# Altium schematic sheet LoRaSubsystem.SchDoc
size A4; SheetNumber: 3; SheetTotal: 14
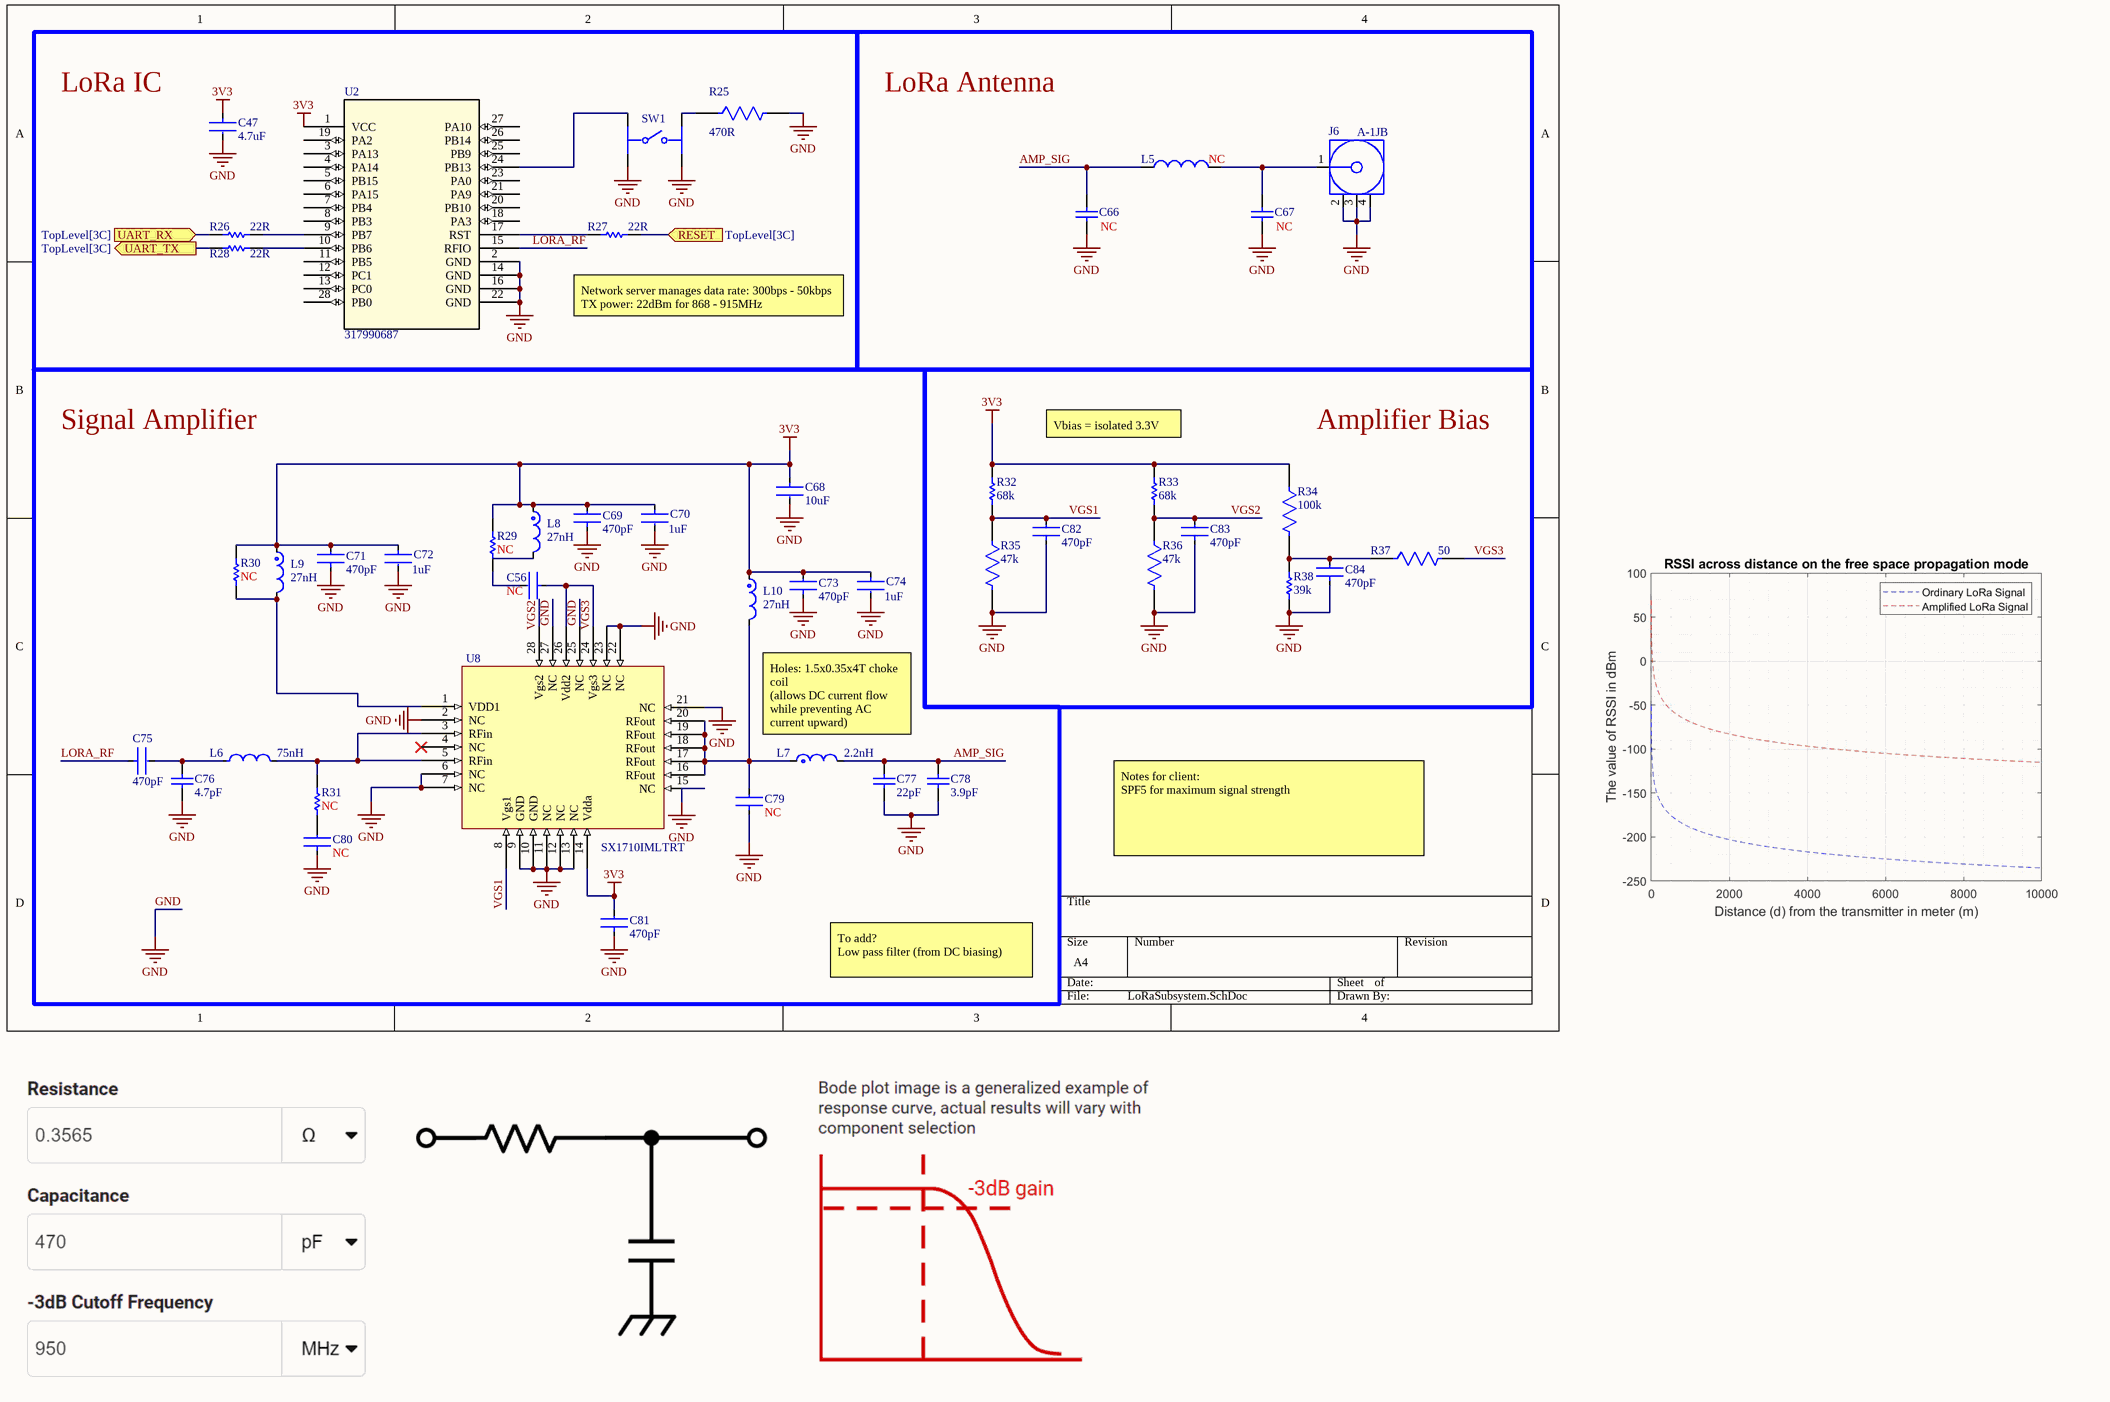
[diagram p0: LoRaSubsystem.SchDoc]

## Parts
C47  4.7uF  [FP-C1005-050-0_15-MFG]
C56  NC  [FP-C0603C-CF-MFG]
C66  NC  [CAPC1005X55X25LL05T10]
C67  NC  [CAPC1005X55X25LL05T10]
C68  10uF  [FP-GRM188-0_2-MFG]
C69  470pF  [FP-C0603C-CF-MFG]
C70  Capacitance: 1uF  [FP-CL511-IPC_C]  (hidden comment: CL05A105KP5NNNC)
C71  470pF  [FP-C0603C-CF-MFG]
C72  Capacitance: 1uF  [FP-CL511-IPC_C]  (hidden comment: CL05A105KP5NNNC)
C73  470pF  [FP-C0603C-CF-MFG]
C74  Capacitance: 1uF  [FP-CL511-IPC_C]  (hidden comment: CL05A105KP5NNNC)
C75  470pF  [FP-C0603C-CF-MFG]
C76  4.7pF  [CAPC1006X50X20LL10T10]
C77  22pF  [CAPC1005X55X25NL05T10]
C78  3.9pF  [CAPC1006X50X20ML10T10]
C79  NC  [FP-C0603C-CF-MFG]
C80  NC  [FP-C0603C-CF-MFG]
C81  470pF  [FP-C0603C-CF-MFG]
C82  470pF  [FP-C0603C-CF-MFG]
C83  470pF  [FP-C0603C-CF-MFG]
C84  470pF  [FP-C0603C-CF-MFG]
J6  A-1JB  [AMPH-A-1JB_V]
L5  NC  [INDC1608X90X30LL10T20]
L6  75nH  [FP-LQW15AN_00-W0_5-0_1-MFG]
L7  2.2nH  [FP-LQG18HH_00-IPC_A]
L8  27nH  [FP-LQG15HH_02-IPC_C]
L9  27nH  [FP-LQG15HH_02-IPC_C]
L10  27nH  [FP-LQG15HH_02-IPC_C]
R25  470R  [FP-CRCW0402-e3-MFG]
R26  22R  [RESC1005X40X25LL05T05]
R27  22R  [RESC1005X40X25LL05T05]
R28  22R  [RESC1005X40X25LL05T05]
R29  NC  [RESC1609X50X30NL8T20]
R30  NC  [RESC1609X50X30NL8T20]
R31  NC  [RESC1609X50X30NL8T20]
R32  68k  [RESC2013X70X40NL20T20]
R33  68k  [RESC2013X70X40NL20T20]
R34  100k  [FP-ERA3A-IPC_A]
R35  47k  [FP-ERA6A-IPC_A]
R36  47k  [FP-ERA6A-IPC_A]
R37  50  [FP-FC0402-IPC_C]
R38  39k  [RESC1005X40X25LL05T05]
SW1  PTS645SM43SMTR92LFS  [FP-PTS645SM43SMTR92LFS-MFG]  (value not drawn)
U2  317990687  [QFN_90687_SEE]
U8  SX1710IMLTRT  [QFN50P500X500X100_HS-29N]

## Blocks framed on the sheet
LoRa IC: C47 R25-R28 SW1 U2
LoRa Antenna: C66 C67 J6 L5
Signal Amplifier: C56 C68-C81 L6-L10 R29-R31 U8
Amplifier Bias: C82-C84 R32-R38

## Ports
RESET (in, see TopLevel[3C]), UART_RX (in, see TopLevel[3C]), UART_TX (out, see TopLevel[3C])

## Nets
3V3: C47.1 C68.1 C69.2 C70.1 C71.2 C72.1 C73.2 C74.1 C81.2 L8.1 L9.1 L10.1 R29.2 R30.2 R32.2 R33.2 R34.1 U2.1(VCC) U8.14(Vdda)
GND: C47.2 C66.1 C67.1 C68.2 C69.1 C70.2 C71.1 C72.2 C73.1 C74.2 C76.1 C77.1 C78.1 C79.1 C80.1 C81.1 C82.1 C83.1 C84.1 J6.2 J6.3 J6.4 R25.2 R35.2 R36.2 R38.2 SW1.2 SW1.4 U2.2(GND) U2.14(GND) U2.16(GND) U2.22(GND) U8.2(NC) U8.6(NC) U8.7(NC) U8.9(GND) U8.10(GND) U8.11(NC) U8.12(NC) U8.13(NC) U8.15(NC) U8.21(NC) U8.22(NC) U8.23(NC) U8.25(NC) U8.27(NC)
AMP_SIG: C66.2 C77.2 C78.2 L5.1 L7.2
LORA_RF: C75.1 U2.15(RFIO)
RESET: R27.2 ; port RESET
UART_RX: R26.1 ; port UART_RX
UART_TX: R28.1 ; port UART_TX
VGS1: C82.2 R32.1 R35.1 U8.8(Vgs1)
VGS2: C83.2 R33.1 R36.1 U8.28(Vgs2)
VGS3: C56.1 R37.2 U8.24(Vgs3) U8.26(Vdd2)
NetC56_2: C56.2 R29.1
NetC67_2: C67.2 J6.1 L5.2
NetC75_2: C75.2 C76.2 L6.1
NetC79_2: C79.2 L7.1 L10.2 U8.16(RFout) U8.17(RFout) U8.18(RFout) U8.19(RFout) U8.20(RFout)
NetC80_2: C80.2 R31.1
NetC84_2: C84.2 R34.2 R37.1 R38.1
NetL6_2: L6.2 R31.2 U8.3(RFin) U8.5(RFin)
NetL9_2: L9.2 R30.1 U8.1(VDD1)
NetR25_1: R25.1 SW1.1
NetR26_2: R26.2 U2.9(PB7)
NetR27_1: R27.1 U2.17(RST)
NetR28_2: R28.2 U2.10(PB6)
NetSW1_3: SW1.3 U2.24(PB13)

Not connected (* = marked no-connect by the designer): L8 2; U2 3(PA13) 4(PA14) 5(PB15) 6(PA15) 7(PB4) 8(PB3) 11(PB5) 12(PC1) 13(PC0) 18(PA3) 19(PA2) 20(PB10) 21(PA9) 23(PA0) 25(PB9) 26(PB14) 27(PA10) 28(PB0); U8 4(NC)*

## Notes on the sheet
- (near R27) Network server manages data rate: 300bps - 50kbps
  TX power: 22dBm for 868 - 915MHz
- (near R33) Vbias = isolated 3.3V
- Holes: 1.5x0.35x4T choke coil
  (allows DC current flow while preventing AC current upward)
- Notes for client:
  SPF5 for maximum signal strength
- To add?
  Low pass filter (from DC biasing)

## Library data of the parts
C47 = CMP-2000-05997-2: C1005X5R1A475K050BC; Dielectric Material: Ceramic; Tolerance: 10%; Voltage Rating (DC): 10V; Dielectric: X5R; Series: C; Package Quantity: 10000; Max Operating Temperature: 85°C; Case Code (Imperial): 0402; Lead Free: Lead Free; Packaging: Cut Tape; Voltage Rating: 10V; Min Operating Temperature: -55°C; Thickness: 0.022inch; Width: 0.02inch; Case/Package: 0402; Case Code (Metric): 1005; Capacitance: 4.7uF; Length: 0.039inch; RoHS Compliant: Yes; REACH SVHC: No SVHC; Mount: Surface Mount
C56 C79 C80 = CMP-2006-03816-2: C0603C471K5RACTU; Manufacturer: KEMET; Capacitance: 470 pF; Temperature Characteristic: X7R; Tolerance: 0.1; Temperature Coefficient: 30ppm/°C; Material: Ceramic; Automotive Grade: Grade 1; Value: 470 pF; Voltage Rating: 50 V; Manufacturer Part Number: C0603C471K5RACTU; Mouser Description: Ceramic Capacitor, 470Pf, 50V, X7R, 10%, 0603, Full Reel; Height: 0.87mm; Temperature: -55°C to +125°C; RoHS: TRUE; Lead Free: Yes; Category: Cap; ComponentLink2URL: https://api.kemet.com/component-edge/download/datasheet/C0603C100J5GACAUTO.pdf; Device Class L3: Ceramic Capacitors; Temperature Range High: +125°C; Package: C0603C-CF; Automotive: Yes; Device Class L2: Capacitors; Device Class L1: Passive Components; Digikey Description: CAP CER 470PF 50V X7R 0603; Temperature Range Low: -55°C; ComponentLink2Description: Datasheet; Octopart: https://octopart.com/c0603c471k5ractu-kemet-89311
C66 C67 = CMP-2008-04368-1: GRM1555C1H470JA01D; Manufacturer: Murata; Part Number: GRM1555C1H470JA01D
C68 = CMP-06035-002932-1: Chip Multilayer Ceramic Capacitors for General Purpose, 0603, 10uF, X6S, 22%, 20%, 10V; Case Code (Metric): 1608; Max Operating Temperature: 105°C; Voltage Rating (DC): 10V; Thickness: 0.031inch; Width: 0.031inch; Dielectric: X6S; Lead Free: Lead Free; REACH SVHC: No SVHC; Case/Package: 0603; Length: 0.063inch; Min Operating Temperature: -55°C; Package Quantity: 4000; Voltage Rating: 10V; Tolerance: 20%; Capacitance: 10uF; Packaging: Cut Tape; Material: Ceramic; Mount: Surface Mount; Case Code (Imperial): 0603; Height: 0.8mm
C69 C71 C73 C75 C81-C84 = CMP-2006-03816-2: C0603C471K5RACTU; Manufacturer: KEMET; Temperature Characteristic: X7R; Tolerance: 0.1; Temperature Coefficient: 30ppm/°C; Material: Ceramic; Automotive Grade: Grade 1; Voltage Rating: 50 V; Capacitance: 470 pF; Manufacturer Part Number: C0603C471K5RACTU; Mouser Description: Ceramic Capacitor, 470Pf, 50V, X7R, 10%, 0603, Full Reel; Height: 0.87mm; Temperature: -55°C to +125°C; RoHS: TRUE; Lead Free: Yes; Category: Cap; ComponentLink2URL: https://api.kemet.com/component-edge/download/datasheet/C0603C100J5GACAUTO.pdf; Device Class L3: Ceramic Capacitors; Temperature Range High: +125°C; Package: C0603C-CF; Automotive: Yes; Device Class L2: Capacitors; Device Class L1: Passive Components; Value: 470 pF; Digikey Description: CAP CER 470PF 50V X7R 0603; Temperature Range Low: -55°C; ComponentLink2Description: Datasheet; Octopart: https://octopart.com/c0603c471k5ractu-kemet-89311
C70 C72 C74 = CMP-13271-001936-1: Cap Ceramic 1uF 10V X5R ±10% SMD 0402 +85°C Paper T/R; Depth: 0.5mm; Case Code (Imperial): 0402; Material: Ceramic; Mount: Surface Mount; Thickness: 0.022inch; Dielectric: X5R; Radiation Hardening: No; Case/Package: 0402; Length: 1mm; Tolerance: 10%; Max Operating Temperature: 85°C; Package Quantity: 1; Width: 0.02inch; Voltage Rating: 10V; Contact Plating: Tin; Height: 0.5mm; Min Operating Temperature: -55°C; Case Code (Metric): 1005; Packaging: Tape and Reel
C76 = CMP-2008-04810-1: 04023J4R7BBSTR; Manufacturer: AVX Interconnect / Elco; Part Number: 04023J4R7BBSTR
C77 = CMP-2008-04304-1: GRM1555C1H220JZ01D; Manufacturer: Murata; Part Number: GRM1555C1H220JZ01D
C78 = CMP-2008-04803-1: 04023J3R9BBSTR; Manufacturer: AVX Interconnect / Elco; Part Number: 04023J3R9BBSTR
J6 = CMP-1743-00001-1: AMC PCB Jack, 0 to 60 GHz, 60 V, -40 to 90 degC, 4-Pin SMD, RoHS, Tape and Reel; Capacitance: 100 uF; Case\Package: 2917; Voltage Rating (DC): 10 V; ESR: 700 mohm; Tolerance: 10%; ComponentLink1Description: Datasheet; PackageDescription: 4-Pin Surface Mount Device, Body 2.6 x 2.6 mm; Radiation Hardening: No; Package Quantity: 1; REACH SVHC: No SVHC; DatasheetVersion: Rev. K, 05/2016; ComponentLink1URL: http://drawings.amphenolrf.com/Customer_Outline/CA-1JB.pdf; Pins: 2; Packaging: Tape and Reel; Min Operating Temperature: -55 degC; RoHSCompliant: true; Length: 7.3 mm; PackageReference: A-1JB; Weight: 0.023634 oz; Mount: Surface Mount; Voltage Rating: 10 V; Max Operating Temperature: 125 degC; Height: 3.1 mm; Case Code (Imperial): 2917; Case Code (Metric): 7343; Width: 4.3 mm
L5 = CMP-2000-05913-1: B82496C3330J; Manufacturer: EPCOS-(TDK); Type: Wirewound; Q @ Freq: 14@100MHz; Inductance: 33nH; Shielding: Unshielded; Material - Core: Ceramic; Frequency - Self Resonant: 3GHz; DC Resistance (DCR): 600mOhmMax; Tolerance: ±5%; Frequency - Test: 100MHz; Current Rating: 350mA; Manufacturer URL: http://www.tdk.com/; Mounting Type: SurfaceMount; Mounting Technology: SurfaceMount; Height - Seated (Max): 0.035"(0.90mm); Datasheet URL: https://en.tdk.eu/inf/30/db/ind_2008/b82496c.pdf; Operating Temperature: -; Size / Dimension: 0.063"Lx0.031"W(1.60mmx0.80mm); Series: SIMID; Current - Saturation: -; Ratings: AEC-Q200; Packaging: CutTape(CT); Package Reference: 0603; Datasheet Version: 07/2016; Category: Inductors,Coils,Chokes; Package Description: 2-Pin Surface Mount Device, Body 1.6 x 0.8 mm; Family: FixedInductors; Package / Case: 0603(1608Metric)
L6 = CMP-06042-002714-1: LQW15AN75NG00D; Test Frequency: 100MHz; Shielding: Unshielded; Self Resonant Frequency: 2.4GHz; Tolerance: 2%; Core Material: Air; Q Factor: 20; Current Rating: 135mA; Current: 125mA; DC Resistance (DCR): 2.1R; Inductance: 75nH; Case Code (Metric): 1005; Package Quantity: 10000; Packaging: Tape and Reel; Mount: Surface Mount; Height: 0.5mm; Termination: SMD/SMT; Min Operating Temperature: -55°C; Weight: 2.8E-05oz; Lead Free: Lead Free; Length: 1mm; Case Code (Imperial): 0402; Max DC Current: 135mA; Width: 0.02inch; Military Standard: Not; Case/Package: 0402; Depth: 0.6mm; DC Current: 135mA; Max Operating Temperature: 125°C
L7 = CMP-06042-006288-1: LQG18HN2N2S00D; Max DC Current: 500mA; Core Material: Air; Self Resonant Frequency: 6GHz; Q Factor: 12; DC Resistance (DCR): 100mR; Shielding: Unshielded; Test Frequency: 100MHz; Inductance: 2.2nH; Depth: 0.95mm; Current Rating: 500mA; Packaging: Tape and Reel; Case/Package: 0603; Height - Seated (Max): 0.037inch; Mount: Surface Mount; Radiation Hardening: No; Max Operating Temperature: 85°C; Length: 0.063inch; Termination: SMD/SMT; Lead Free: Lead Free; Min Operating Temperature: -40°C; Number of Pins: 2; Case Code (Metric): 1608; Height: 0.8mm; REACH SVHC: No SVHC; Package Quantity: 4000; DC Current: 500mA; Width: 0.031inch; Military Standard: Not; Case Code (Imperial): 0603
L8-L10 = CMP-2000-06578-2: LQG15HS27NJ02D; DC Current: 300mA; Core Material: Air; Tolerance: 5%; Self Resonant Frequency: 1.7GHz; Q Factor: 8; DC Resistance (DCR): 460mR; Shielding: Unshielded; Test Frequency: 100MHz; Inductance: 27nH; Width: 0.02inch; Length: 1mm; Height - Seated (Max): 0.022inch; Military Standard: Not; Case Code (Imperial): 0402; Depth: 0.55mm; Current Rating: 300mA; Inductance Tolerance: 5%; Lead Free: Lead Free; Height: 0.5mm; Max DC Current: 300mA; REACH SVHC: No SVHC; Package Quantity: 10000; Mount: Surface Mount; Termination: SMD/SMT; Case Code (Metric): 1005; Case/Package: 0402; Max Operating Temperature: 125°C; Packaging: Tape and Reel; Min Operating Temperature: -55°C
R25 = CMP-2002-00022-2: CRCW0402470RFKED; Tolerance: 1%; Power Rating: 63mW; Voltage Rating (DC): 50V; Temperature Coefficient: 100ppm/°C; Case Code (Imperial): 0402; Lead Free: Lead Free; Max Operating Temperature: 155°C; Military Standard: Not; Height: 0.35mm; Termination: SMD/SMT; Mount: Surface Mount; Features: Automotive AEC-Q200; Composition: Thick Film; Case Code (Metric): 1005; Package Quantity: 10; Radiation Hardening: No; Max Power Dissipation: 63mW; Weight: 2.3E-05oz; Width: 0.5mm; Length: 1mm; Depth: 0.5mm; Min Operating Temperature: -55°C; Voltage Rating: 50V; Case/Package: 0402; Packaging: Tape and Reel; Contact Plating: Tin; Resistance: 470R; Number of Terminations: 2
R26-R28 = CMP-2002-08382-1: CRCW040222R0FKED; Manufacturer: Vishay Dale; Part Number: CRCW040222R0FKED
R29-R31 = CMP-1666-00005-4: CRCW060310K0FKEA; Manufacturer: Vishay Semiconductor; Voltage Rating: 75 V; Max Operating Temperature: 155 degC; PackageDescription: 2-Pin Surface Mount Device, Body 1.575 x 0.85 mm; ComponentLink1Description: Manufacturer URL; RoHSCompliant: true; PackageReference: 0603; REACH SVHC: Unknown; Length: 1.55 mm; DatasheetVersion: 06/2012; Packaging: Tape and Reel; Min Operating Temperature: -55 degC; Mounting Technology: Surface Mount; ComponentLink2URL: https://datasheet.ciiva.com/11809/0900766b80d98afc-11809037.pdf; Height: 0.45 mm; ComponentLink2Description: Datasheet; Package Quantity: 5000; ComponentLink1URL: http://www.vishay.com/
R32 R33 = CMP-2001-00568-1: ERJ6ENF6802V; Manufacturer: Panasonic; Part Number: ERJ6ENF6802V
R34 = CMP-2000-00875-2: ERA-3AEB104V; NexarPartId: 1243428; Power Rating: 100mW; Voltage Rating (DC): 75V; Tolerance: 0.1%; Temperature Coefficient: 25ppm/°C; Resistance: 100kΩ; Contact Plating: Tin; Max Operating Temperature: 155°C; Case Code (Imperial): 0603; Packaging: Cut Tape; Width: 800µm; Lead Free: Lead Free; REACH SVHC: No SVHC; Termination: SMD/SMT; Radiation Hardening: No; Length: 1.6mm; Military Standard: Not; Features: Automotive AEC-Q200; Case/Package: 0603; Number of Terminations: 2; Composition: Thin Film; Schedule B: 8533210045, 8533210045; Voltage Rating: 75V; Mount: Surface Mount; Case Code (Metric): 1608; Lifecycle Status: Production; Height: 450µm; RoHS: Compliant; Number of Pins: 2; Max Power Dissipation: 100mW; Min Operating Temperature: -55°C; Depth: 800µm; Working Voltage: 75V
R35 R36 = CMP-2001-00645-2: ERA-6AEB473V; NexarPartId: 1264112; Voltage Rating (DC): 100V; Max Power Dissipation: 125mW; Resistance: 47kΩ; Temperature Coefficient: 25ppm/°C; Tolerance: 0.1%; Case Code (Metric): 2012; Packaging: Cut Tape; Number of Terminations: 2; Max Operating Temperature: 155°C; Height: 500µm; Number of Pins: 2; Min Operating Temperature: -55°C; RoHS: Compliant; Features: Automotive AEC-Q200; Schedule B: 8533210045, 8533210045; Contact Plating: Tin; Case Code (Imperial): 0805; Lead Free: Lead Free; Lifecycle Status: Production; Termination: SMD/SMT; Weight: 5.499807mg; REACH SVHC: No SVHC; Voltage Rating: 100V; Mount: Surface Mount; Radiation Hardening: No; Military Standard: Not; Power Rating: 125mW; Length: 2mm; Depth: 1.25mm; Width: 1.25mm; Composition: Metal Film, Thin Film; Case/Package: 0805
R37 = CMP-02407-013075-1: FC0402E50R0BTBST1; Frequency: 20GHz; Voltage Rating (DC): 30V; Resistance: 50R; Resistance Tolerance: 0.1%; Power Rating: 50mW; Temperature Coefficient: 25ppm/°C; Resistor Type: Thin Film; Max Operating Temperature: 155°C; Case Code (Metric): 1005; Number of Terminations: 2; Height: 0.015inch; Min Operating Temperature: -55°C; Packaging: Tape and Reel; Package Quantity: 1; Radiation Hardening: No; Case Code (Imperial): 0402; Termination: SMD/SMT; Case/Package: 0402; Series: FC; Number of Pins: 2; Tolerance: 0.1%; Width: 0.022inch; Length: 0.042inch; Max Power Dissipation: 50mW; Voltage Rating: 30V; RoHS Compliant: Yes
R38 = CMP-2002-08569-1: CRCW040239K0FKED; Manufacturer: Vishay Dale; Part Number: CRCW040239K0FKED
SW1 = CMP-2000-05160-2: SWITCH TACTILE SPST-NO 0.05A 12V; Contact Resistance: 100mR; Throw Configuration: SPST; Illumination Type: Non-Illuminated; Mechanical Life: 100000Cycles; Current Rating: 50mA; Switch Function: Off-Mom; Actuator Length: 0.85mm; Actuator Material: Nylon; Actuator Type: Standard; Operating Force: 160gf; Min Operating Temperature: -20°C; REACH SVHC: No SVHC; Termination: Gull Wing; Case/Package: SMD/SMT; Packaging: Tape and Reel; Mount: Surface Mount; Voltage Rating (DC): 12V; Orientation: Straight; Lead Free: Lead Free; Contact Material: Silver; Color: Black; Max Current Rating: 50mA; Contact Plating: Silver; Depth: 9mm; Package Quantity: 1; Max Voltage Rating (DC): 12V; Length: 6mm; Max Operating Temperature: 60°C
U2 = 317990687: No Description Available; Mfr_Name: BeagleBoard; RefDes: RefDes; Type: Type
U8 = CMP-00025-00003-2: Broadband High Efficiency RF Power Amplifier; Frequency: 1GHz; Voltage Rating: 5V; Max Operating Temperature: -45°C; Min Operating Temperature: 80°C; Case/Package: QFN-28; Pins: 28; Mounting Technology: SMD